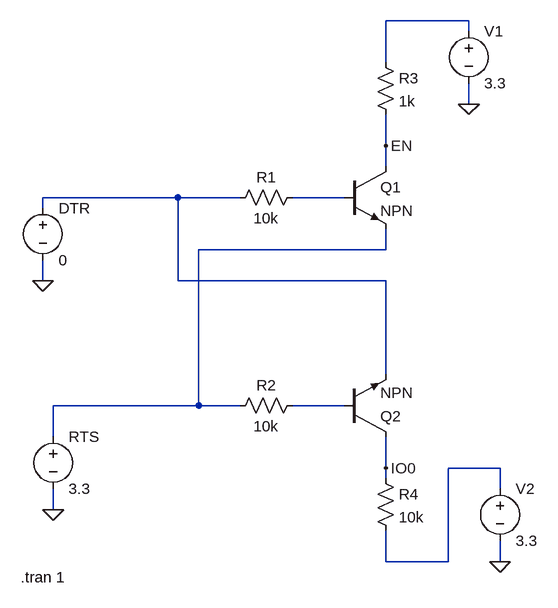
[diagram p0: schematic auto-boot.asc]
auto-boot.asc, the LTspice schematic file:
Version 4
SHEET 1 880 728
WIRE 320 -144 192 -144
WIRE 320 -128 320 -144
WIRE 192 -80 192 -144
WIRE 320 -16 320 -48
WIRE 192 48 192 0
WIRE 192 80 192 48
WIRE -128 128 -336 128
WIRE -32 128 -128 128
WIRE 128 128 48 128
WIRE -336 144 -336 128
WIRE 192 208 192 176
WIRE 192 208 -96 208
WIRE -336 256 -336 224
WIRE -128 256 -128 128
WIRE 192 256 -128 256
WIRE 192 400 192 256
WIRE -96 448 -96 208
WIRE -96 448 -320 448
WIRE -32 448 -96 448
WIRE 128 448 48 448
WIRE -320 496 -320 448
WIRE 192 544 192 496
WIRE 368 544 288 544
WIRE 192 560 192 544
WIRE 368 576 368 544
WIRE -320 608 -320 576
WIRE 192 688 192 640
WIRE 288 688 288 544
WIRE 288 688 192 688
WIRE 368 688 368 656
FLAG 320 -16 0
FLAG 368 688 0
FLAG 192 48 EN
FLAG 192 544 IO0
FLAG -336 256 0
FLAG -320 608 0
SYMBOL npn 128 80 R0
SYMATTR InstName Q1
SYMBOL npn 128 496 M180
SYMATTR InstName Q2
SYMBOL res 64 112 R90
WINDOW 0 0 56 VBottom 2
WINDOW 3 32 56 VTop 2
SYMATTR InstName R1
SYMATTR Value 10k
SYMBOL res 64 432 R90
WINDOW 0 0 56 VBottom 2
WINDOW 3 32 56 VTop 2
SYMATTR InstName R2
SYMATTR Value 10k
SYMBOL voltage 320 -144 R0
SYMATTR InstName V1
SYMATTR Value 3.3
SYMBOL voltage 368 560 R0
SYMATTR InstName V2
SYMATTR Value 3.3
SYMBOL res 176 -96 R0
SYMATTR InstName R3
SYMATTR Value 1k
SYMBOL res 176 544 R0
SYMATTR InstName R4
SYMATTR Value 10k
SYMBOL voltage -336 128 R0
SYMATTR InstName DTR
SYMATTR Value 0
SYMBOL voltage -320 480 R0
SYMATTR InstName RTS
SYMATTR Value 3.3
TEXT -370 712 Left 2 !.tran 1

The netlist it stands for:
* auto-boot.asc
Q1 EN N003 N004 0 NPN
Q2 IO0 N005 N002 0 NPN
R1 N003 N002 10k
R2 N005 N004 10k
V1 N001 0 3.3
V2 N006 0 3.3
R3 N001 EN 1k
R4 IO0 N006 10k
V§DTR N002 0 0
V§RTS N004 0 3.3
.model NPN NPN
.model PNP PNP
.lib standard.bjt
.tran 1
.backanno
.end